# EAGLE design Programmer Board (EAGLE 9.4.2)
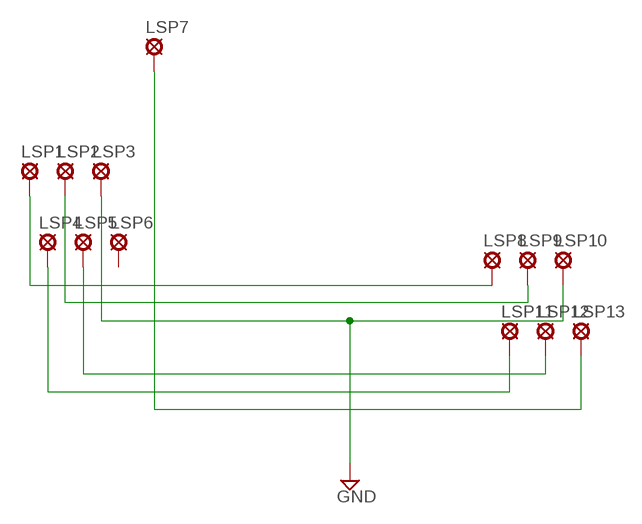
[diagram p0: schematic, sheet 1]

## Parts
LSP1  LSP10_CLSP10_C  [LSP10_C]
LSP2  LSP10_CLSP10_C  [LSP10_C]
LSP3  LSP10_CLSP10_C  [LSP10_C]
LSP4  LSP10_CLSP10_C  [LSP10_C]
LSP5  LSP10_CLSP10_C  [LSP10_C]
LSP6  LSP10_CLSP10_C  [LSP10_C]
LSP7  LSP10_CLSP10_C  [LSP10_C]
LSP8  LSP10_CLSP10_C  [LSP10_C]
LSP9  LSP10_CLSP10_C  [LSP10_C]
LSP10  LSP10_CLSP10_C  [LSP10_C]
LSP11  LSP10_CLSP10_C  [LSP10_C]
LSP12  LSP10_CLSP10_C  [LSP10_C]
LSP13  LSP10_CLSP10_C  [LSP10_C]

## Nets
GND: LSP3.P$1(MP) LSP10.P$1(MP)
N$1: LSP1.P$1(MP) LSP8.P$1(MP)
N$2: LSP2.P$1(MP) LSP9.P$1(MP)
N$4: LSP4.P$1(MP) LSP11.P$1(MP)
N$5: LSP5.P$1(MP) LSP12.P$1(MP)
N$6: LSP7.P$1(MP) LSP13.P$1(MP)
Unconnected: LSP6.P$1(MP)

## Library data of the parts
LSP1-LSP13 = tbtaco-solpad:LSP10_C: SOLDER PAD drill 1.0 mm, distributor Buerklin, 12H555

## Board
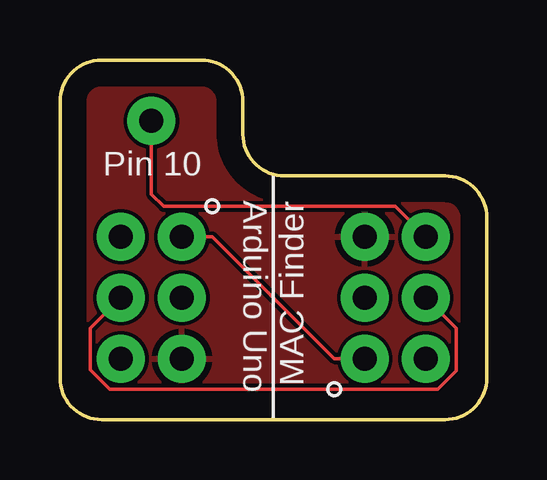
[diagram p1: board, top side]
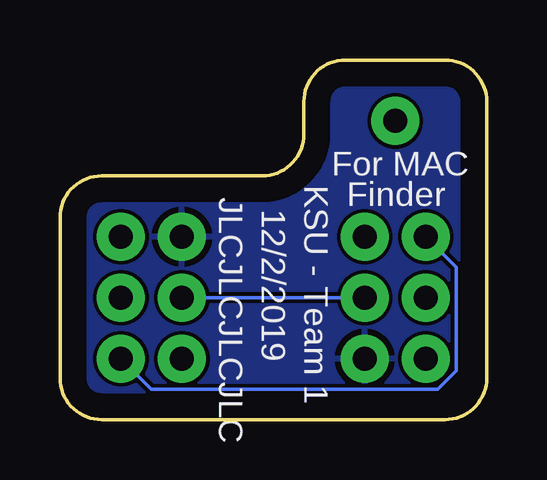
[diagram p2: board, bottom side, seen from below]

Size 17.78 x 14.99 mm. Coordinates in mm from the lower left corner, seen from the top.
Outline: 1.73,14.99 5.89,14.99 arc-90 7.62,13.25 7.62,11.89 arc90 9.35,10.16 16.05,10.16 arc-90 17.78,8.43 17.78,1.73 arc-90 16.05,0 1.73,0 arc-90 0,1.73 0,13.25 arc-90 1.73,14.99
Copper layers (1*16): Top 0.035mm / dielectric 1.5mm / Bottom 0.035mm
Design rules "default": minimum track width 6mil, minimum drill 0.35mm, track to track 6mil, track to pad 6mil, pad to pad 6mil, via to via 6mil, smd to smd 6mil, copper to edge 40mil, drill to drill 6mil, minimum pad ring 10mil, minimum via ring 8mil, stop-mask expansion 4mil, vias tented up to drill 0mil, thermal gap 10mil

### Footprints (pad centres in the part's own frame; a part is rotated, then mirrored left to right if it is on the bottom)
LSP10_C = drill 1 pad 2: P$1 0,0

### Placement (x,y rotation side)
LSP1  5.08,7.62 0 top
LSP2  5.08,5.08 0 top
LSP3  5.08,2.54 0 top
LSP4  2.54,7.62 0 top
LSP5  2.54,5.08 0 top
LSP6  2.54,2.54 0 top
LSP7  3.81,12.45 0 top
LSP8  12.7,2.54 0 top
LSP9  12.7,5.08 0 top
LSP10  12.7,7.62 0 top
LSP11  15.24,2.54 0 top
LSP12  15.24,5.08 0 top
LSP13  15.24,7.62 0 top

### Tracks (layer width: path | path; a pad name or v marks a point on that pad's centre or on a via)
GND
  pour Top: 0,14.99 0,0 17.78,0 17.78,10.16 9.4,10.16 7.62,11.94 7.62,14.99
  pour Bottom: 0,14.99 0,0 17.78,0 17.78,10.16 9.4,10.16 7.62,11.94 7.62,14.99
N$1
  Top 0.152: LSP1.P$1 6.35,7.62 11.43,2.54 LSP8.P$1
N$2
  Bottom 0.152: LSP2.P$1 LSP9.P$1
N$4
  Bottom 0.152: LSP11.P$1 13.97,1.27 2.03,1.27 1.27,2.03 1.27,6.35 LSP4.P$1
N$5
  Top 0.152: LSP12.P$1 16.51,3.81 16.51,2.03 15.75,1.27 2.07,1.27 1.27,2.07 1.27,3.81 LSP5.P$1
N$6
  Top 0.152: LSP13.P$1 13.97,8.89 4.32,8.89 3.81,9.4 LSP7.P$1

### Text on the board
tPlace: Pin 10 | Arduino Uno | MAC Finder
bPlace: For MAC | KSU - Team 1 | JLCJLCJLCJLC | Finder | 12/2/2019